# Altium schematic sheet Mother Board Power.SchDoc
size A4
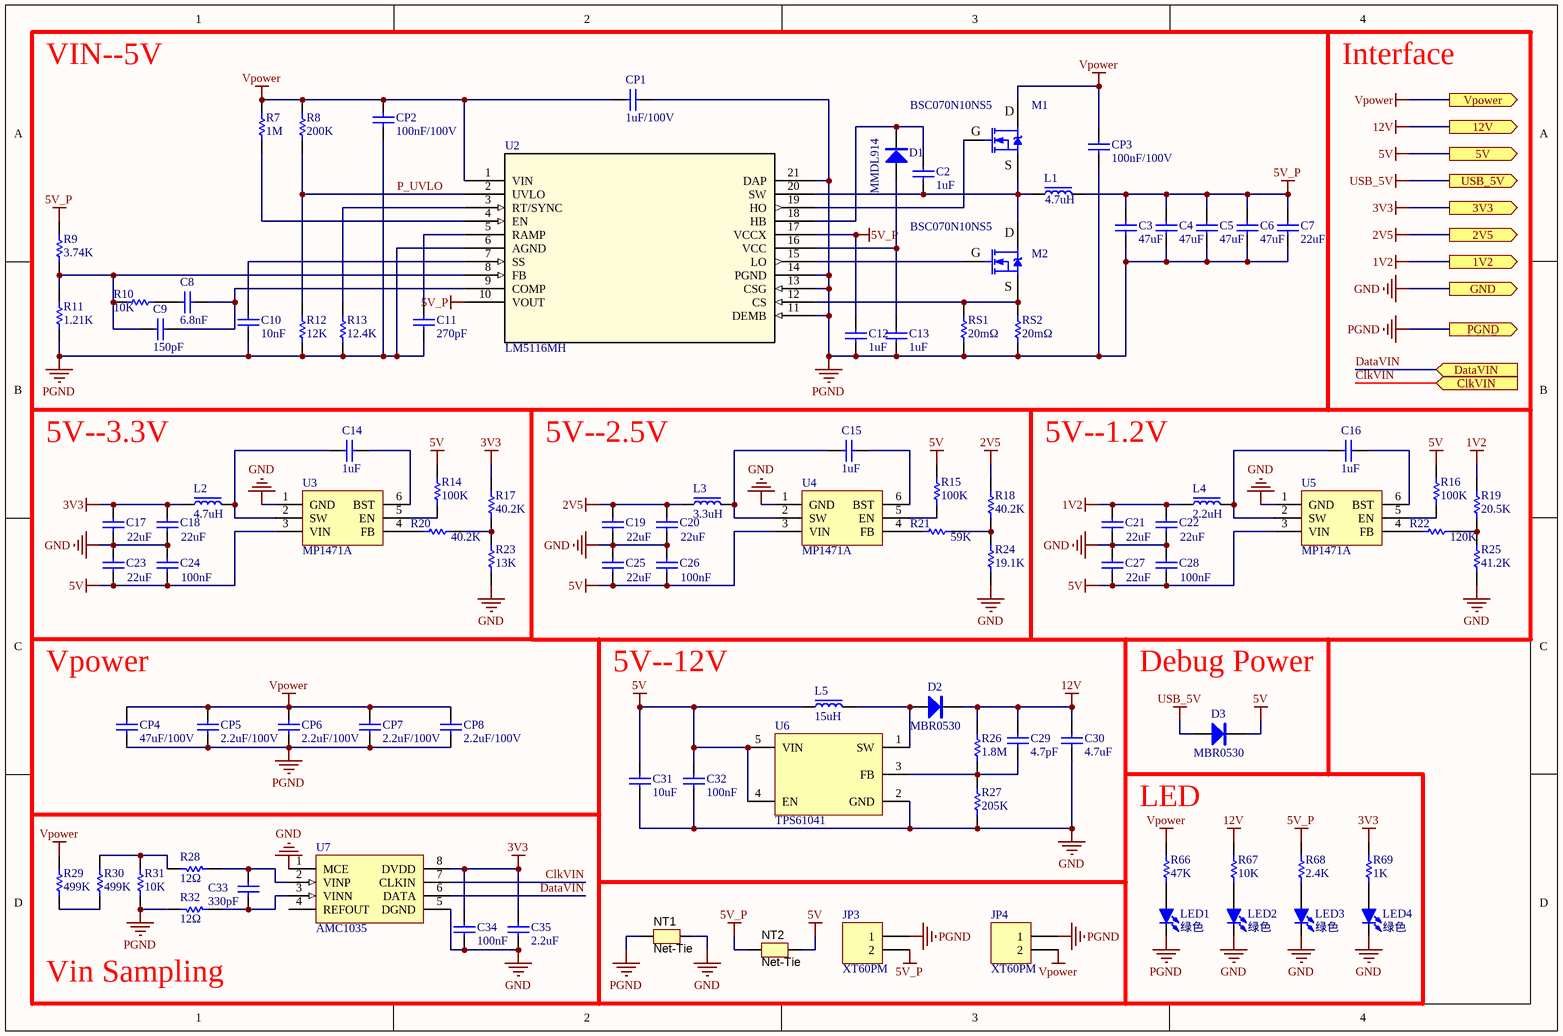
[diagram p0: Mother Board Power.SchDoc]

## Parts
C2  1uF  [C0805]
C3  47uF  [C0805]
C4  47uF  [C0805]
C5  47uF  [C0805]
C6  47uF  [C0805]
C7  22uF  [C0805]
C8  6.8nF  [C0603]
C9  150pF  [C0603]
C10  10nF  [C0603]
C11  270pF  [C0603]
C12  1uF  [C0805]
C13  1uF  [C0805]
C14  1uF  [C0603]
C15  1uF  [C0603]
C16  1uF  [C0603]
C17  22uF  [C0805]
C18  22uF  [C0805]
C19  22uF  [C0805]
C20  22uF  [C0805]
C21  22uF  [C0805]
C22  22uF  [C0805]
C23  22uF  [C0805]
C24  100nF  [C0603]
C25  22uF  [C0805]
C26  100nF  [C0603]
C27  22uF  [C0805]
C28  100nF  [C0603]
C29  4.7pF  [C0603]
C30  4.7uF  [C0805]
C31  10uF  [C0805]
C32  100nF  [C0603]
C33  330pF  [C0603]
C34  100nF  [C0603]
C35  2.2uF  [C0603]
CP1  1uF/100V  [C1206]
CP2  100nF/100V  [C1206]
CP3  100nF/100V  [C1206]
CP4  47uF/100V  [C1206]
CP5  2.2uF/100V  [C1206]
CP6  2.2uF/100V  [C1206]
CP7  2.2uF/100V  [C1206]
CP8  2.2uF/100V  [C1206]
D1  MMDL914  [SOD-323]
D2  MBR0530  [SOD-123]
D3  MBR0530  [SOD-123]
JP3  XT60PM  [XT60PM]
JP4  XT60PM  [XT60PM]
L1  4.7uH  [L 1040]
L2  4.7uH  [L 0530]
L3  3.3uH  [L 0530]
L4  2.2uH  [L 0530]
L5  15uH  [L 0530]
LED1  绿色  [LED 0603G L]
LED2  绿色  [LED 0603G L]
LED3  绿色  [LED 0603G L]
LED4  绿色  [LED 0603G L]
M1  BSC070N10NS5  [TDSON-8]
M2  BSC070N10NS5  [TDSON-8]
NT1  Net-Tie  [Net-Tie_80mil]  (net tie, no BOM)
NT2  Net-Tie  [Net-Tie_80mil]  (net tie, no BOM)
R7  1M  [R0603]
R8  200K  [R0603]
R9  3.74K  [R0603]
R10  10K  [R0603]
R11  1.21K  [R0603]
R12  12K  [R0603]
R13  12.4K  [R0603]
R14  100K  [R0603]
R15  100K  [R0603]
R16  100K  [R0603]
R17  40.2K  [R0603]
R18  40.2K  [R0603]
R19  20.5K  [R0603]
R20  40.2K  [R0603]
R21  59K  [R0603]
R22  120K  [R0603]
R23  13K  [R0603]
R24  19.1K  [R0603]
R25  41.2K  [R0603]
R26  1.8M  [R0603]
R27  205K  [R0603]
R28  12Ω  [R0603]
R29  499K  [R0603]
R30  499K  [R0603]
R31  10K  [R0603]
R32  12Ω  [R0603]
R66  47K  [R0603]
R67  10K  [R0603]
R68  2.4K  [R0603]
R69  1K  [R0603]
RS1  20mΩ  [R1206]
RS2  20mΩ  [R1206]
U2  LM5116MH  [MXA20A_TEX-L]
U3  MP1471A  [SOT23-6L]
U4  MP1471A  [SOT23-6L]
U5  MP1471A  [SOT23-6L]
U6  TPS61041  [SOT23-5L]
U7  AMC1035  [SOP8_L]

## Ports
1V2 (out), 2V5 (out), 3V3 (out), 5V (out), 12V (out), ClkVIN (in), DataVIN (in), GND (out), PGND (out), USB_5V (out), Vpower (out)

## Nets
1V2: C21.1 C22.1 L4.1 R19.2 ; port 1V2
2V5: C19.1 C20.1 L3.1 R18.2 ; port 2V5
3V3: C17.1 C18.1 C34.1 C35.1 L2.1 R17.2 R69.1 U7.8(DVDD) ; port 3V3
5V: C23.2 C24.2 C25.2 C26.2 C27.2 C28.2 C31.2 C32.2 D3.K L5.1 NT2.2 R14.1 R15.1 R16.1 U3.3(VIN) U4.3(VIN) U5.3(VIN) U6.4(EN) U6.5(VIN) ; port 5V
5V_P: C3.1 C4.1 C5.1 C6.1 C7.1 C12.1 JP3.2 L1.2 NT2.1 R9.2 R68.1 U2.10(VOUT) U2.17(VCCX)
12V: C29.2 C30.2 D2.K R26.1 R67.1 ; port 12V
GND: C17.2 C18.2 C19.2 C20.2 C21.2 C22.2 C23.1 C24.1 C25.1 C26.1 C27.1 C28.1 C30.1 C31.1 C32.1 C34.2 C35.2 LED2.K LED3.K LED4.K NT1.2 R23.2 R24.2 R25.2 R27.2 U3.1(GND) U4.1(GND) U5.1(GND) U6.2(GND) U7.1(MCE) U7.5(DGND) ; port GND
PGND: C3.2 C4.2 C5.2 C6.2 C7.2 C10.1 C11.1 C12.2 C13.2 CP1.2 CP2.1 CP3.1 CP4.2 CP5.2 CP6.2 CP7.2 CP8.2 JP3.1 JP4.1 LED1.K NT1.1 R11.2 R12.2 R13.2 R31.1 R32.1 RS1.1 RS2.1 U2.6(AGND) U2.11(DEMB) U2.13(CSG) U2.14(PGND) U2.21(DAP) ; port PGND
USB_5V: D3.A ; port USB_5V
Vpower: CP1.1 CP2.2 CP3.2 CP4.1 CP5.1 CP6.1 CP7.1 CP8.1 JP4.2 M1.D R7.1 R8.2 R29.2 R66.1 U2.1(VIN) ; port Vpower
ClkVIN: U7.7(CLKIN) ; port ClkVIN
DataVIN: U7.6(DATA) ; port DataVIN
P_UVLO: R8.1 R12.1 U2.2(UVLO)
NetC2_1: C2.1 L1.1 M1.S M2.D U2.20(SW)
NetC2_2: C2.2 D1.K U2.18(HB)
NetC8_1: C8.1 R10.2
NetC8_2: C8.2 C9.2 U2.9(COMP)
NetC9_1: C9.1 R9.1 R10.1 R11.1 U2.8(FB)
NetC10_2: C10.2 U2.7(SS)
NetC11_2: C11.2 U2.5(RAMP)
NetC13_1: C13.1 D1.A U2.16(VCC)
NetC14_1: C14.1 L2.2 U3.2(SW)
NetC14_2: C14.2 U3.6(BST)
NetC15_1: C15.1 L3.2 U4.2(SW)
NetC15_2: C15.2 U4.6(BST)
NetC16_1: C16.1 L4.2 U5.2(SW)
NetC16_2: C16.2 U5.6(BST)
NetC29_1: C29.1 R26.2 R27.1 U6.3(FB)
NetC33_1: C33.1 R32.2 U7.3(VINN)
NetC33_2: C33.2 R28.2 U7.2(VINP)
NetD2_A: D2.A L5.2 U6.1(SW)
NetLED1_A: LED1.A R66.2
NetLED2_A: LED2.A R67.2
NetLED3_A: LED3.A R68.2
NetLED4_A: LED4.A R69.2
NetM1_G: M1.G U2.19(HO)
NetM2_G: M2.G U2.15(LO)
NetM2_S: M2.S RS1.2 RS2.2 U2.12(CS)
NetR7_2: R7.2 U2.4(EN)
NetR13_1: R13.1 U2.3(RT/SYNC)
NetR14_2: R14.2 U3.5(EN)
NetR15_2: R15.2 U4.5(EN)
NetR16_2: R16.2 U5.5(EN)
NetR17_1: R17.1 R20.1 R23.1
NetR18_1: R18.1 R21.1 R24.1
NetR19_1: R19.1 R22.1 R25.1
NetR20_2: R20.2 U3.4(FB)
NetR21_2: R21.2 U4.4(FB)
NetR22_2: R22.2 U5.4(FB)
NetR28_1: R28.1 R30.1 R31.2
NetR29_1: R29.1 R30.2

Not connected (* = marked no-connect by the designer): U7 4(REFOUT)

## Notes on the sheet
- VIN--5V
- Interface
- 5V--3.3V
- 5V--2.5V
- 5V--1.2V
- (near CP4) Vpower
- 5V--12V
- Debug Power
- LED
- Vin Sampling

## Library data of the parts
C2-C35 CP1-CP8 = Cap
D1 = MMDL914: 100V 0.2A开关管
D2 D3 = MBR0530: 30V 0.5A
L1-L5 = L-CDRH: 功率屏蔽电感
LED1-LED4 = LED-SMD: 贴片LED; 版权归属: 源创客; BOM名称: 贴片LED; 学习资源: www.ooocke.com
M1 M2 = BSC070N10NS5: N沟场效应管
NT1 NT2 = Net-Tie: Single point connection between nets.; SymbolCreator: codlsc; SymbolVersion: 2009-07-01; MountType: SMT; Publisher: Texas Instruments; LatestRevisionDate: 2013-04-21; LatestRevisionNote: Added Alternate PartNumber and Alternate Manufacturer parameters to appropriate components.
R7-R32 R66-R69 RS1 RS2 = RES
U2 = LM5116MH: No Description Available; Mfr_Name: Texas Instruments; Copyright: Copyright (C) 2021 Ultra Librarian. All rights reserved.; Manufacturer_Part_Number: LM5116MH; RefDes: RefDes; Type: DEV
U3-U5 = MP1471A: 4.5-16V输入 DC-DC Buck 芯片
U6 = TPS6104x: Boost DC-DC